# EAGLE schematic SNES_Basic (EAGLE 6.5.0)
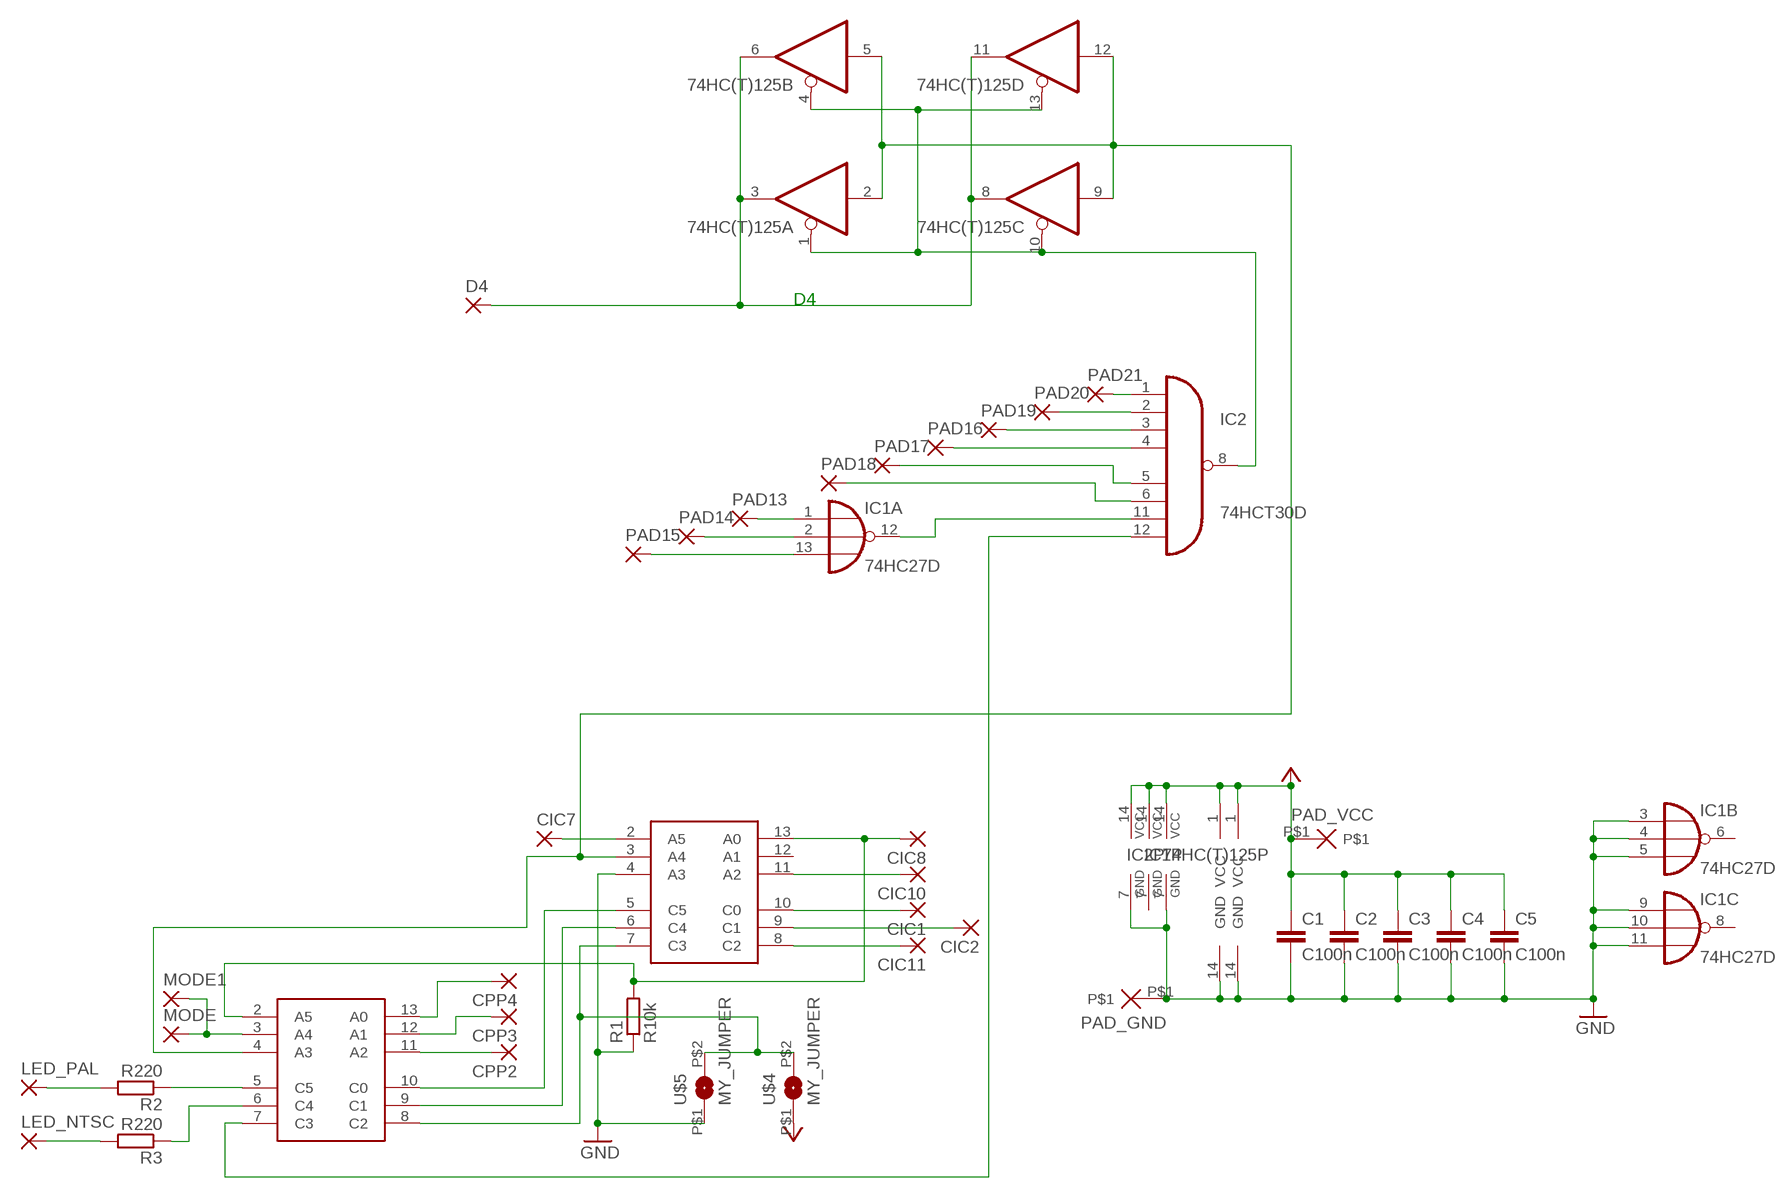
[diagram p0: schematic, sheet 1]

## Parts
74HC(T)125  74HCT125D  [SO14]
C1  C100n  C0805  [Z0805]
C2  C100n  C0805  [Z0805]
C3  C100n  C0805  [Z0805]
C4  C100n  C0805  [Z0805]
C5  C100n  C0805  [Z0805]
CIC1  SMD2  [SMD1,27-2,54]
CIC2  SMD2  [SMD1,27-2,54]
CIC7  SMD2  [SMD1,27-2,54]
CIC8  SMD2  [SMD1,27-2,54]
CIC10  SMD2  [SMD1,27-2,54]
CIC11  SMD2  [SMD1,27-2,54]
CPP2  SMD2  [SMD1,27-2,54]
CPP3  SMD2  [SMD1,27-2,54]
CPP4  SMD2  [SMD1,27-2,54]
D4  SMD2  [SMD1,27-2,54]
IC1  74HC27D  [SO14]
IC2  74HCT30D  [SO14]
LED_NTSC  SMD2  [SMD1,27-2,54]
LED_PAL  SMD2  [SMD1,27-2,54]
MODE  SMD2  [SMD1,27-2,54]
MODE1  SMD2  [SMD1,27-2,54]
PAD13  SMD2  [SMD1,27-2,54]
PAD14  SMD2  [SMD1,27-2,54]
PAD15  SMD2  [SMD1,27-2,54]
PAD16  SMD2  [SMD1,27-2,54]
PAD17  SMD2  [SMD1,27-2,54]
PAD18  SMD2  [SMD1,27-2,54]
PAD19  SMD2  [SMD1,27-2,54]
PAD20  SMD2  [SMD1,27-2,54]
PAD21  SMD2  [SMD1,27-2,54]
PAD_GND  PAD  [PADS]
PAD_VCC  PAD  [PADS]
R1  R10k  R0805  [Z0805]
R2  R220  R0805  [Z0805]
R3  R220  R0805  [Z0805]
U$2  PIC16F630_SIMPLE  [PIC16F630]
U$3  PIC16F630_SIMPLE  [PIC16F630]
U$4  MY_JUMPER  [MYJUMP]
U$5  MY_JUMPER  [MYJUMP]

## Nets
D4_ON/OFF: IC2.12(I7) U$3.7(C3)
GND: 74HC(T)125.7(P:GND) C1.2 C2.2 C3.2 C4.2 C5.2 IC1.3(B:I0) IC1.4(B:I1) IC1.5(B:I2) IC1.9(C:I0) IC1.10(C:I1) IC1.11(C:I2) IC2.7(GND) PAD_GND.P$1 R1.1 U$2.4(A3) U$2.14(GND) U$3.14(GND) U$5.P$1
N$1: LED_PAL.1(P) R2.2
N$2: 74HC(T)125.1(A:OE) 74HC(T)125.4(B:OE) 74HC(T)125.10(C:OE) 74HC(T)125.13(D:OE) IC2.8(O)
N$3: CIC10.1(P) U$2.11(A2)
N$4: IC2.5(I4) PAD17.1(P)
N$5: IC2.4(I3) PAD16.1(P)
N$6: IC2.3(I2) PAD19.1(P)
N$7: IC2.2(I1) PAD20.1(P)
N$8: IC2.1(I0) PAD21.1(P)
N$9: CIC7.1(P) U$2.2(A5)
N$10: CIC8.1(P) R1.2 U$2.13(A0) U$3.2(A5)
N$11: IC1.1(A:I0) PAD13.1(P)
N$12: R2.1 U$3.5(C5)
N$13: R3.1 U$3.6(C4)
N$14: LED_NTSC.1(P) R3.2
N$15: IC2.6(I5) PAD18.1(P)
N$16: IC1.12(A:O) IC2.11(I6)
N$18: IC1.13(A:I2) PAD15.1(P)
N$19: U$2.5(C5) U$3.10(C0)
N$22: IC1.2(A:I1) PAD14.1(P)
N$33: CPP2.1(P) U$3.11(A2)
N$34: CPP3.1(P) U$3.12(A1)
N$42: 74HC(T)125.3(A:O) 74HC(T)125.6(B:O) 74HC(T)125.8(C:O) 74HC(T)125.11(D:O) D4.1(P)
N$46: CPP4.1(P) U$3.13(A0)
N$48: CIC1.1(P) U$2.10(C0)
N$49: CIC2.1(P) U$2.9(C1)
N$51: CIC11.1(P) U$2.8(C2)
N$52: U$2.6(C4) U$3.9(C1)
N$53: U$2.7(C3) U$3.8(C2) U$4.P$2 U$5.P$2
N$56: MODE1.1(P) MODE.1(P) U$3.3(A4)
UIGR: 74HC(T)125.2(A:I) 74HC(T)125.5(B:I) 74HC(T)125.9(C:I) 74HC(T)125.12(D:I) U$2.3(A4) U$3.4(A3)
VCC: 74HC(T)125.14(P:VCC) C1.1 C2.1 C3.1 C4.1 C5.1 IC1.14(P:VCC) IC2.14(VCC) PAD_VCC.P$1 U$2.1(VCC) U$3.1(VCC) U$4.P$1
Unconnected: IC1.6(B:O) IC1.8(C:O) U$2.12(A1)

## Notes on the sheet
- D4

## Power pins joined to a net without a drawn wire
GND: IC1.7(P:GND)

## Library data of the parts
74HC(T)125 = 74xx-eu:74*125: Quad bus BUFFER, 3-state
C1-C5 = snescart:C0805
CIC1 CIC2 CIC7 CIC8 CIC10 CIC11 CPP2-CPP4 D4 LED_NTSC LED_PAL MODE MODE1 PAD13-PAD21 = wirepad:SMD2: SMD PAD
IC1 = 74xx-eu:74*27: Triple 3-input NOR gate
IC2 = 74xx-eu:74*30: 8-input NAND gate
PAD_GND PAD_VCC = snescart:PAD
R1-R3 = snescart:R0805
U$2 U$3 = snescart:PIC16F630_SIMPLE
U$4 U$5 = snescart:MY_JUMPER